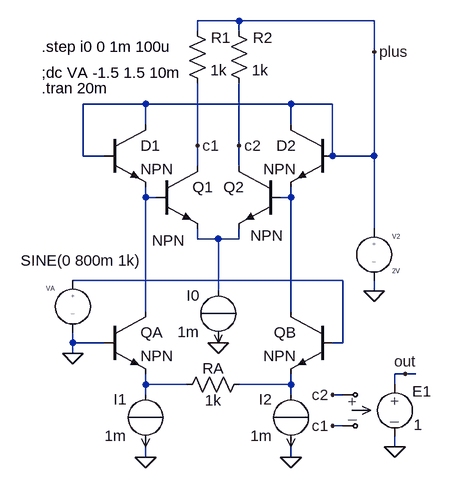
[diagram p0: schematic 2q-mult.asc]
2q-mult.asc, the LTspice schematic file:
Version 4
SHEET 1 880 680
WIRE 288 -304 224 -304
WIRE 496 -304 288 -304
WIRE 224 -288 224 -304
WIRE 288 -288 288 -304
WIRE 496 -256 496 -304
WIRE 144 -176 48 -176
WIRE 368 -176 144 -176
WIRE 432 -176 368 -176
WIRE 144 -144 144 -176
WIRE 368 -144 368 -176
WIRE 224 -112 224 -208
WIRE 288 -112 288 -208
WIRE 48 -96 48 -176
WIRE 80 -96 48 -96
WIRE 432 -96 432 -176
WIRE 496 -96 496 -256
WIRE 496 -96 432 -96
WIRE 224 -80 224 -112
WIRE 288 -80 288 -112
WIRE 144 -32 144 -48
WIRE 160 -32 144 -32
WIRE 368 -32 368 -48
WIRE 368 -32 352 -32
WIRE 496 16 496 -96
WIRE 224 32 224 16
WIRE 256 32 224 32
WIRE 288 32 288 16
WIRE 288 32 256 32
WIRE 448 96 32 96
WIRE 256 112 256 32
WIRE 496 112 496 96
WIRE 144 144 144 -32
WIRE 368 144 368 -32
WIRE 32 192 32 176
WIRE 80 192 32 192
WIRE 448 192 448 96
WIRE 448 192 432 192
WIRE 32 208 32 192
WIRE 544 240 528 240
WIRE 560 240 544 240
WIRE 144 256 144 240
WIRE 208 256 144 256
WIRE 368 256 368 240
WIRE 368 256 288 256
WIRE 528 256 528 240
WIRE 144 272 144 256
WIRE 368 272 368 256
WIRE 448 272 432 272
WIRE 448 320 432 320
WIRE 528 352 528 336
WIRE 144 368 144 352
WIRE 368 368 368 352
FLAG 32 208 0
FLAG 144 368 0
FLAG 368 368 0
FLAG 496 112 0
FLAG 496 -256 plus
FLAG 256 192 0
FLAG 224 -112 c1
FLAG 288 -112 c2
FLAG 528 352 0
FLAG 544 240 out
FLAG 432 272 c2
FLAG 432 320 c1
SYMBOL EIT_Semiconductors\\npn 80 144 R0
SYMATTR InstName QA
SYMBOL EIT_Semiconductors\\npn 432 144 M0
SYMATTR InstName QB
SYMBOL source-V 32 80 M0
WINDOW 3 -105 -15 Left 2
WINDOW 123 0 0 Left 2
WINDOW 39 0 0 Left 2
SYMATTR InstName VA
SYMATTR Value SINE(0 800m 1k)
SYMBOL res 304 240 R90
WINDOW 0 7 56 VBottom 2
WINDOW 3 25 56 VTop 2
SYMATTR InstName RA
SYMATTR Value 1k
SYMBOL source-I 144 352 R180
WINDOW 0 29 73 Left 2
WINDOW 3 29 17 Left 2
SYMATTR InstName I1
SYMATTR Value 1m
SYMBOL source-I 368 352 R180
WINDOW 0 29 73 Left 2
WINDOW 3 29 17 Left 2
SYMATTR InstName I2
SYMATTR Value 1m
SYMBOL source-V 496 0 R0
SYMATTR InstName V2
SYMATTR Value 2V
SYMBOL EIT_Semiconductors\\npn 80 -144 R0
SYMATTR InstName D1
SYMBOL EIT_Semiconductors\\npn 432 -144 M0
SYMATTR InstName D2
SYMBOL EIT_Semiconductors\\npn 160 -80 R0
WINDOW 3 -6 114 Left 2
SYMATTR InstName Q1
SYMBOL EIT_Semiconductors\\npn 352 -80 M0
WINDOW 3 -4 107 Left 2
SYMATTR InstName Q2
SYMBOL source-I 256 192 R180
WINDOW 0 29 73 Left 2
WINDOW 3 29 17 Left 2
SYMATTR InstName I0
SYMATTR Value 1m
SYMBOL res 208 -304 R0
WINDOW 0 37 26 Left 2
SYMATTR InstName R1
SYMATTR Value 1k
SYMBOL res 272 -304 R0
WINDOW 0 37 26 Left 2
SYMATTR InstName R2
SYMATTR Value 1k
SYMBOL crtl-V-V 528 240 R0
SYMATTR InstName E1
SYMATTR Value 1
TEXT -16 -224 Left 2 !;dc VA -1.5 1.5 10m
TEXT -16 -264 Left 2 !.step i0 0 1m 100u
TEXT -16 -200 Left 2 !.tran 20m

The netlist it stands for:
* 2q-mult.asc
QA N001 0 N005 0 NPN
QB N002 N004 N006 0 NPN
VA N004 0 SINE(0 800m 1k)
RA N006 N005 1k
I1 N005 0 1m
I2 N006 0 1m
V2 plus 0 2V
Q§D1 plus plus N001 0 NPN
Q§D2 plus plus N002 0 NPN
Q1 c1 N001 N003 0 NPN
Q2 c2 N002 N003 0 NPN
I0 N003 0 1m
R1 plus c1 1k
R2 plus c2 1k
E1 out 0 c2 c1 1
.model NPN NPN
.model PNP PNP
.lib standard.bjt
;dc VA -1.5 1.5 10m
.step i0 0 1m 100u
.tran 20m
.backanno
.end